# Altium schematic sheet 2_FLYBACK_AUXILIAR.SchDoc (part 1 of 3)
size Tabloid; SheetNumber: 2; SheetTotal: 2; SPICEModelCacheAFXYMUIJ: <root> / <DocumentId>AFXYMUIJ</DocumentId> / <CacheFrame Number="0"> / <Model Name="0805_885012107018_4.7uf" Kind="CKT"> / <Text>******* / .subckt 0805_885012107018_4.7uF 1 2 / Rser 1 3 0.00349429730952 / Lser 2 4 2.52123218E-10 / C1 3 4 0.0000047 / Rpar 3 4 20000000 / .ends 0805_885012107018_4.7uF</Text> / </Model> / <Model Name="1206_885342008007_2.2nf" Kind="CKT"> / <Text>******* / .subckt 1206_885342008007_2.2nF 1 2 / Rser 1 3 0.0317456317923 / Lser 2 4 6.20552358E-10 / C1 3 4 0.0000000022 / Rpar 3 4 10000000000 / .ends 1206_885342008007_2.2nF</Text> / </Model> / <Model Name="0603_885012206068_33nf" Kind="CKT"> / <Text>******* / .subckt 0603_885012206068_33nF 1 2 / Rser 1 3 0.0232 / Lser 2 4 0.00000000033089 / C1 3 4 0.000000033 / Rpar 3 4 10000000000 / .ends 0603_885012206068_33nF</Text> / </Model> / <Model Name="860040374004_220uf" Kind="CKT"> / <Text>******* / .subckt 860040374004_220uF 1 2 / Rser 1 3 0.08 / Lser 2 4 0.000000004 / C1 3 4 0.00022 / Rpar 3 4 454545.454545455 / .ends 860040374004_220uF</Text> / </Model> / <Model Name="0603_885012006042_470pf" Kind="CKT"> / <Text>******* / .subckt 0603_885012006042_470pF 1 2 / Rser 1 3 0.0647178553788 / Lser 2 4 3.67931779E-10 / C1 3 4 0.00000000047 / Rpar 3 4 10000000000 / .ends 0603_885012006042_470pF</Text> / </Model> / <Model Name="860080474008_150uf" Kind="CKT"> / <Text>******* / .subckt 860080474008_150uF 1 2 / Rser 1 3 0.067 / Lser 2 4 0.000000009 / C1 3 4 0.00015 / Rpar 3 4 666666.666666667 / .ends 860080474008_150uF</Text> / </Model> / </CacheFrame> / </root>
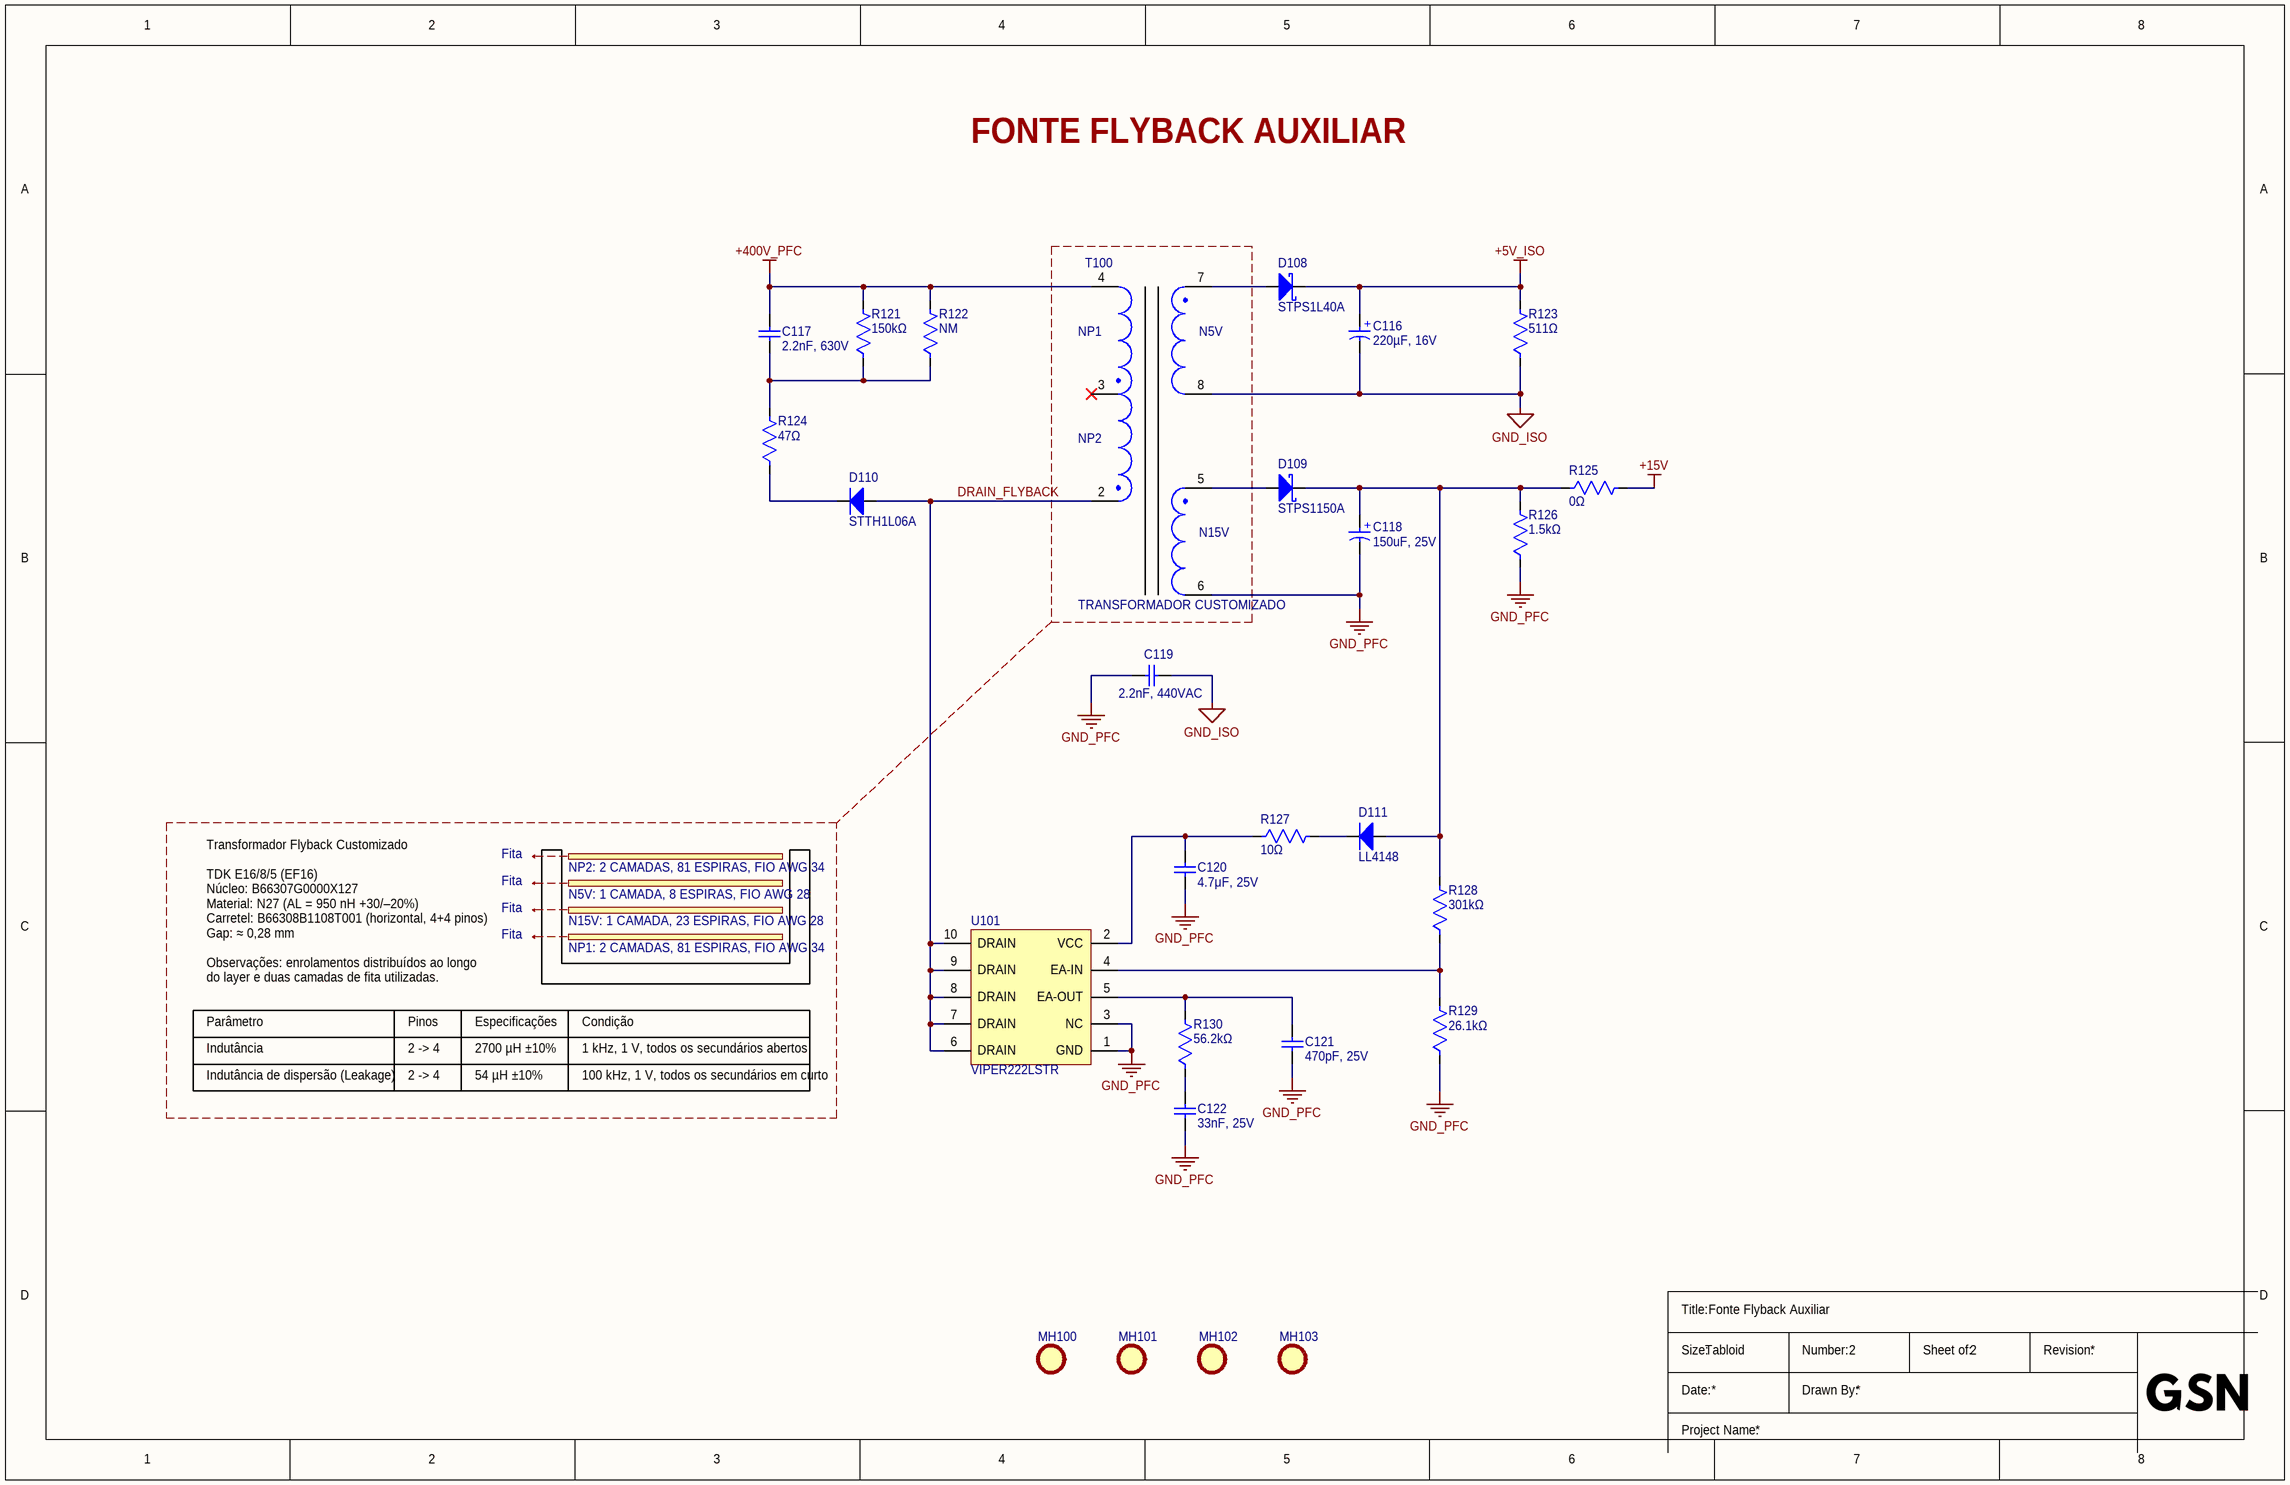
[diagram p0: 2_FLYBACK_AUXILIAR.SchDoc]

## Parts
C116  220µF, 16V  [WCAP-ATUL_D8H11.5]
C117  2.2nF, 630V  [WCAP-CSMH_1206_H1.6]
C118  150uF, 25V  [WCAP-ATLI_D8H11.5]
C119  2.2nF, 440VAC  [CAP_5US63V7_VIS]
C120  4.7μF, 25V  [WCAP-CSGP_0805_L2W1.25H1.25]
C121  470pF, 25V  [WCAP-CSGP_0603_L1.6W0.8H0.8_Wave]
C122  33nF, 25V  [WCAP-CSGP_0603_L1.6W0.8H0.8_Wave]
D108  STPS1L40A  [SMA]
D109  STPS1150A  [SMA]
D110  STTH1L06A  [SMA]
D111  LL4148  [SOD-80-DIODE]
MH100  Mounting Hole 2.5mm  [MOUNTING_HOLE_M2P5_UNPLATED]  (value not drawn)  (no BOM)
MH101  Mounting Hole 2.5mm  [MOUNTING_HOLE_M2P5_UNPLATED]  (value not drawn)  (no BOM)
MH102  Mounting Hole 2.5mm  [MOUNTING_HOLE_M2P5_UNPLATED]  (value not drawn)  (no BOM)
MH103  Mounting Hole 2.5mm  [MOUNTING_HOLE_M2P5_UNPLATED]  (value not drawn)  (no BOM)
R121  150kΩ  [2010-WAVE]
R122  NM  [2010-WAVE]
R123  511Ω  [1206-WAVE]
R124  47Ω  [1206-WAVE]
R125  0Ω  [1206-WAVE]
R126  1.5kΩ  [1206-WAVE]
R127  10Ω  [0603-WAVE]
R128  301kΩ  [0603-WAVE]
R129  26.1kΩ  [0603-WAVE]
R130  56.2kΩ  [0603-WAVE]
T100  TRANSFORMADOR CUSTOMIZADO  [TDK_E_16_8_5]
U101  VIPER222LSTR  [SSOP-10]

## Nets
+5V_ISO: C116.1(P) D108.1(K) R123.2
+15V: R125.2
+400V_PFC: C117.2 R121.2 R122.2 T100.4
GND_ISO: C116.2(N) C119.2 R123.1 T100.8
GND_PFC: C118.2(N) C119.1 C120.1 C121.1 C122.1 R126.1 R129.1 T100.6 U101.1(GND) U101.3(NC)
DRAIN_FLYBACK: D110.2(A) T100.2 U101.6(DRAIN) U101.7(DRAIN) U101.8(DRAIN) U101.9(DRAIN) U101.10(DRAIN)
NetC117_1: C117.1 R121.1 R122.1 R124.2
NetC118_1: C118.1(P) D109.1(K) D111.2(A) R125.1 R126.2 R128.2
NetC120_2: C120.2 R127.1 U101.2(VCC)
NetC121_2: C121.2 R130.2 U101.5(EA-OUT)
NetC122_2: C122.2 R130.1
NetD108_2: D108.2(A) T100.7
NetD109_2: D109.2(A) T100.5
NetD110_1: D110.1(K) R124.1
NetD111_1: D111.1(K) R127.2
NetR128_1: R128.1 R129.2 U101.4(EA-IN)

Not connected (* = marked no-connect by the designer): T100 3*

## Notes on the sheet
- FONTE FLYBACK AUXILIAR
- Fita
- NP2: 2 CAMADAS, 81 ESPIRAS, FIO AWG 34
- N5V: 1 CAMADA, 8 ESPIRAS, FIO AWG 28
- N15V: 1 CAMADA, 23 ESPIRAS, FIO AWG 28
- NP1: 2 CAMADAS, 81 ESPIRAS, FIO AWG 34
- Parâmetro
- Transformador Flyback Customizado
  TDK E16/8/5 (EF16)
  Núcleo: B66307G0000X127
  Material: N27 (AL = 950 nH +30/–20%)
  Carretel: B66308B1108T001 (horizontal, 4+4 pinos)
  Gap: ≈ 0,28 mm
  Observações: enrolamentos distribuídos ao longo do layer e duas camadas de fita utilizadas.
- Pinos
- Especificações
- Condição
- Indutância
- Indutância de dispersão (Leakage)
- 2 -> 4
- 2700 µH ±10%
- 54 µH ±10%
- 1 kHz, 1 V, todos os secundários abertos
- 100 kHz, 1 V, todos os secundários em curto
- Fonte Flyback Auxiliar
- Title:
- Size:
- Tabloid
- Number:
- Sheet of:
- Revision:
- Date:
- Project Name:
- Drawn By:
- (in symbol 860040374004) +
- (in symbol 860080474008) +
- (in symbol CUSTOM_FLYBACK_TCC) NP1; N5V; NP2; N15V